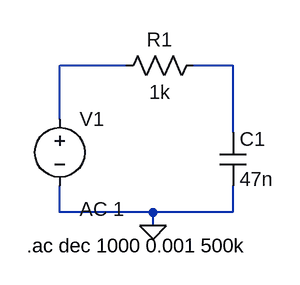
[diagram p0: schematic freq response.asc]
freq response.asc, the LTspice schematic file:
Version 4.1
SHEET 1 880 680
WIRE 176 32 96 32
WIRE 304 32 256 32
WIRE 96 96 96 32
WIRE 304 112 304 32
WIRE 96 208 96 176
WIRE 208 208 96 208
WIRE 304 208 304 176
WIRE 304 208 208 208
WIRE 208 224 208 208
FLAG 208 224 0
SYMBOL voltage 96 80 R0
WINDOW 123 24 124 Left 2
WINDOW 39 0 0 Left 0
SYMATTR InstName V1
SYMATTR Value ""
SYMATTR Value2 AC 1
SYMBOL res 272 16 R90
WINDOW 0 0 56 VBottom 2
WINDOW 3 32 56 VTop 2
SYMATTR InstName R1
SYMATTR Value 1k
SYMBOL cap 288 112 R0
SYMATTR InstName C1
SYMATTR Value 47n
TEXT 56 248 Left 2 !.ac dec 1000 0.001 500k

The netlist it stands for:
* freq response.asc
V1 N001 0 AC 1
R1 N002 N001 1k
C1 N002 0 47n
.ac dec 1000 0.001 500k
.backanno
.end